# EAGLE design Cargador_RasPi3HAT_CamSlot_v1.2 (EAGLE 9.3.0)
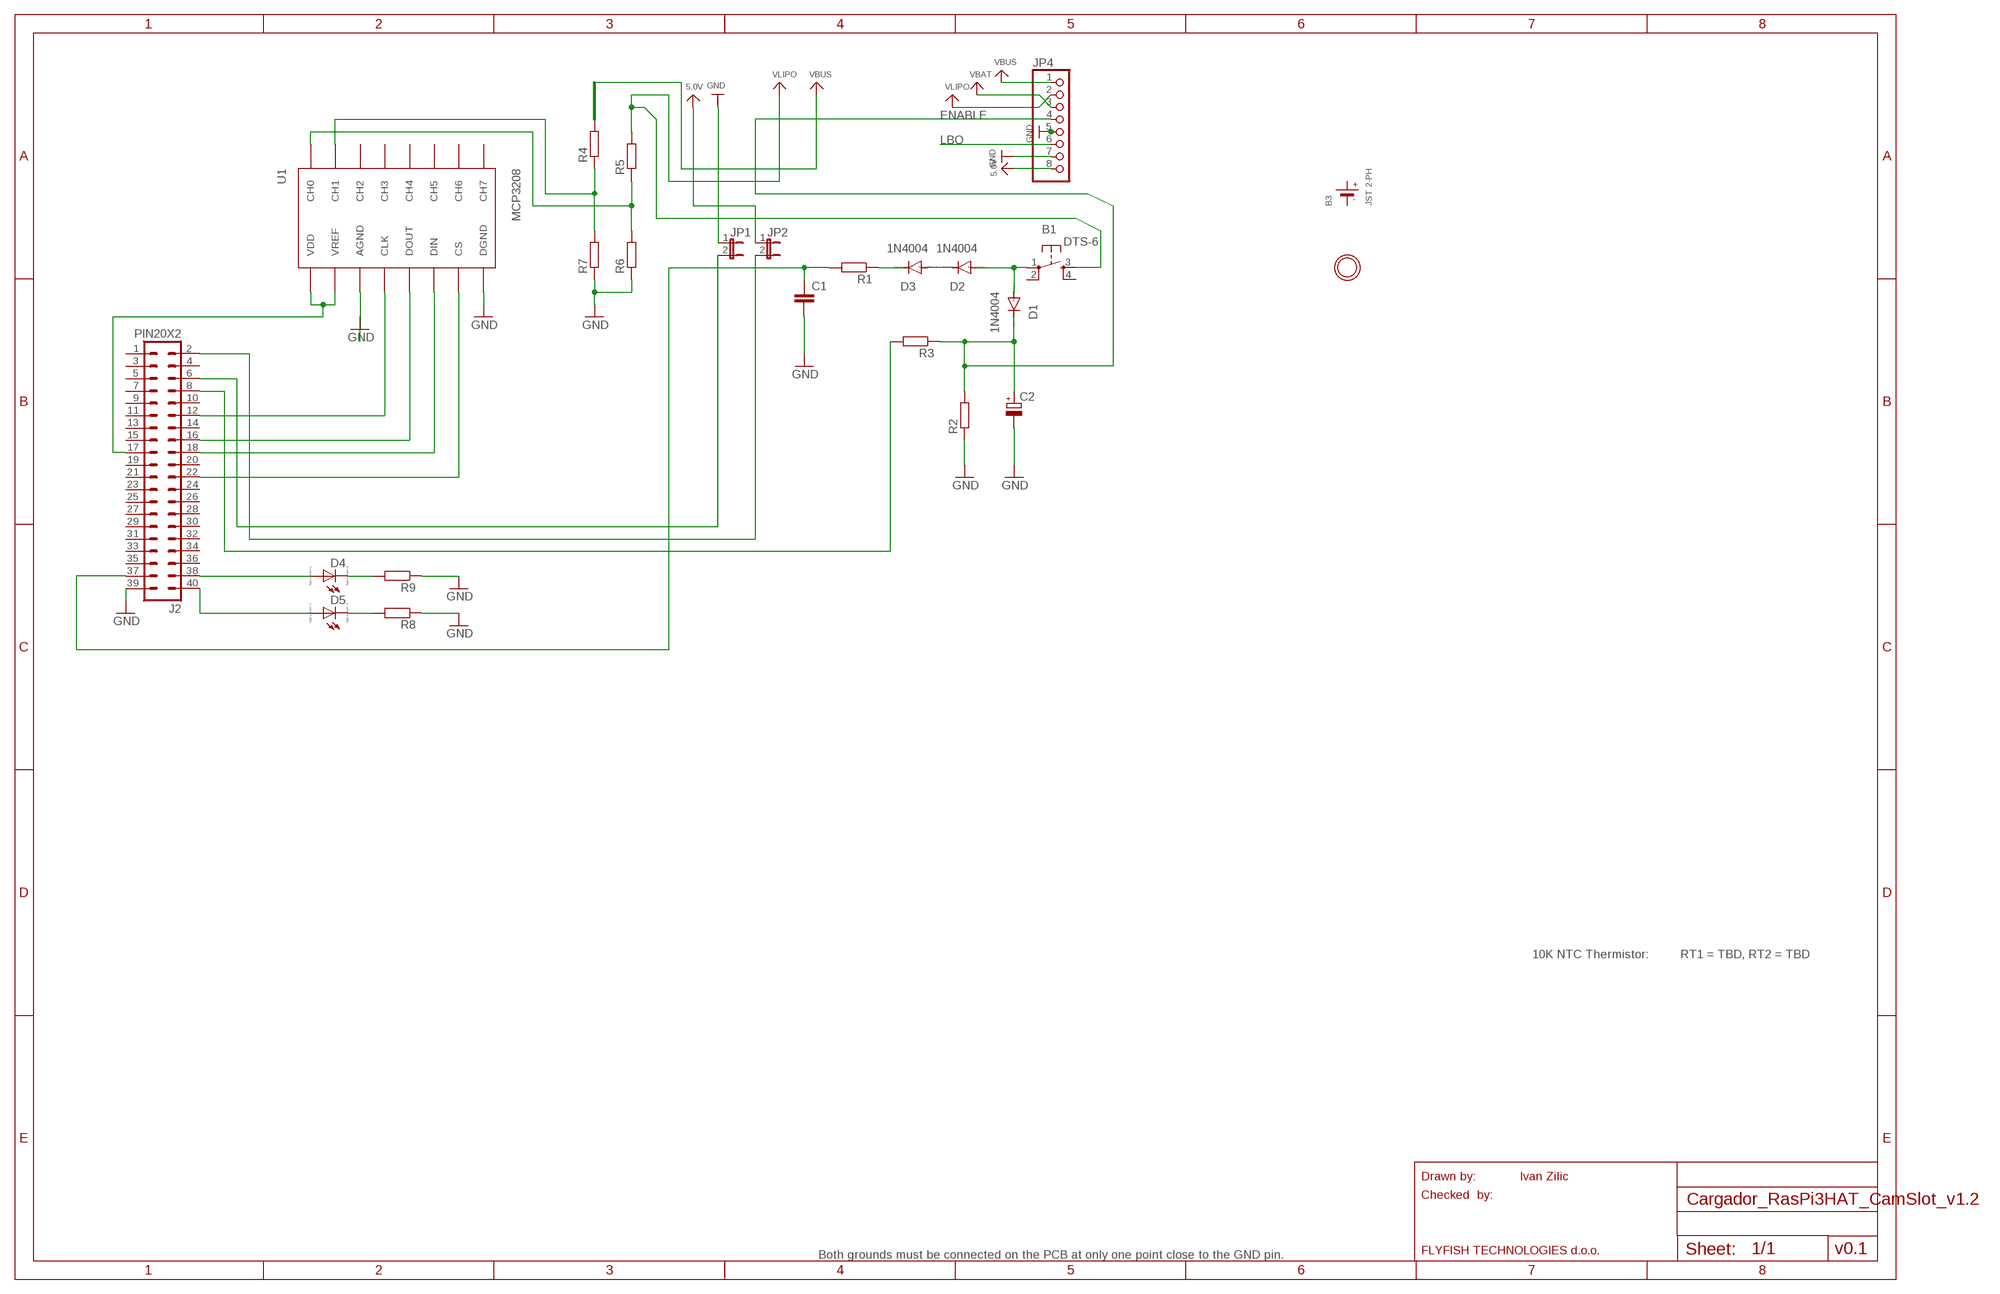
[diagram p0: schematic, sheet 1]

## Parts
B1  DTS-6  [DTS-6]
B3  JST 2-PH  BATTERY  [JSTPH2]
C1  C2.5/2  [C2.5-2]
C2  CPOL-EUE5-4  [E5-4]
D1  1N4004  [DO41-10]
D2  1N4004  [DO41-10]
D3  1N4004  [DO41-10]
D4  LED_ELD260  [LED_LD260]
D5  LED_ELD260  [LED_LD260]
J2  PIN20X2  [PIN_20X2]
JP1  JP1E  [JP1]
JP2  JP1E  [JP1]
JP4  HEADER-1X8  [1X08_OVAL]
R1  R-EU_0207/10  [0207/10]
R2  R-EU_0207/10  [0207/10]
R3  R-EU_0207/10  [0207/10]
R4  R-EU_0207/10  [0207/10]
R5  R-EU_0207/10  [0207/10]
R6  R-EU_0207/10  [0207/10]
R7  R-EU_0207/10  [0207/10]
R8  R-EU_0207/10  [0207/10]
R9  R-EU_0207/10  [0207/10]
U1  MCP3208  [DIL16]
U$5  MOUNTINGHOLE2.5  [MOUNTINGHOLE_2.5_PLATED]

## Nets
5.0V: JP2.1 JP4.8
ENABLE: C2.+ D1.C JP4.4 R2.2 R3.1
GND [GND]: C1.2 C2.- J2.39 JP1.1 JP4.5 JP4.7 R2.1 R6.1 R7.1 R8.1 R9.1 U1.AGND U1.DGND
LBO: JP4.6
N$1: J2.6 JP1.2
N$2: J2.8 R3.2
N$3: D4.K(C) R9.2
N$4: D5.K(C) R8.2
N$5: D3.C R1.1
N$6: D5.A J2.40
N$7: D4.A J2.38
N$8: J2.22 U1.CS
N$9: J2.16 U1.DOUT
N$10: J2.18 U1.DIN
N$11 [GND]: J2.12 U1.CLK
N$12: J2.17 U1.VDD U1.VREF
N$13 [GND]: R4.1 R7.2 U1.CH1
N$14: R5.1 R6.2 U1.CH0
N$20: J2.2 JP2.2
N$21: C1.1 J2.37 R1.2
N$23: D2.C D3.A
N$24 [GND]: B1.1 D1.A D2.A
VBAT: JP4.3
VBUS: JP4.1 R4.2
VLIPO: B1.3 JP4.2 R5.2
Unconnected: B1.2 B1.4 B3.1(-) B3.2(+) J2.1 J2.3 J2.4 J2.5 J2.7 J2.9 J2.10 J2.11 J2.13 J2.14 J2.15 J2.19 J2.20 J2.21 J2.23 J2.24 J2.25 J2.26 J2.27 J2.28 J2.29 J2.30 J2.31 J2.32 J2.33 J2.34 J2.35 J2.36 U1.CH2 U1.CH3 U1.CH4 U1.CH5 U1.CH6 U1.CH7

## Notes on the sheet
- 10K NTC Thermistor: | RT1 = TBD, RT2 = TBD
- Drawn by: | Ivan Zilic
- Checked  by:
- Both grounds must be connected on the PCB at only one point close to the GND pin. | FLYFISH TECHNOLOGIES d.o.o. | v0.1

## Library data of the parts
B1 = switch-tact:DTS-6
B3 = microbuilder:BATTERY: CR1220 SMT - Digikey: 3001K-ND CD2032 BAT-HLD-001 - Digikey: BAT-HLD-001-ND
C1 = capacitor-wima:C: CAPACITOR naming: grid - package width
C2 = rcl:CPOL-EU: POLARIZED CAPACITOR, European symbol; SPICEPREFIX: C
D1-D3 = diode:1N4004: DIODE general purpose rectifier, 1 A
D4 D5 = eagle-ltspice:LED_E: LED Source: http://www.osram.convergy.de Source: www.luxeon.com Source: www.kingbright.com; SPICEMODEL: NONE; SPICEPREFIX: D; SPICETYPE: diode
J2 = FLYFISH:PIN20X2
JP1 JP2 = jumper:JP1E: JUMPER
JP4 = microbuilder:HEADER-1X8: PIN HEADER
R1-R9 = rcl:R-EU_: RESISTOR, European symbol; SPICEPREFIX: R
U1 = mcp3208:MCP3208
U$5 = microbuilder:MOUNTINGHOLE: Mounting Hole For #2 screws (0.086"/2.18mm width, 0.094"/2.4mm hole) use 2.5mm

## Net classes
1 GND: width 0.254 mm, clearance 0.381 mm

## Board
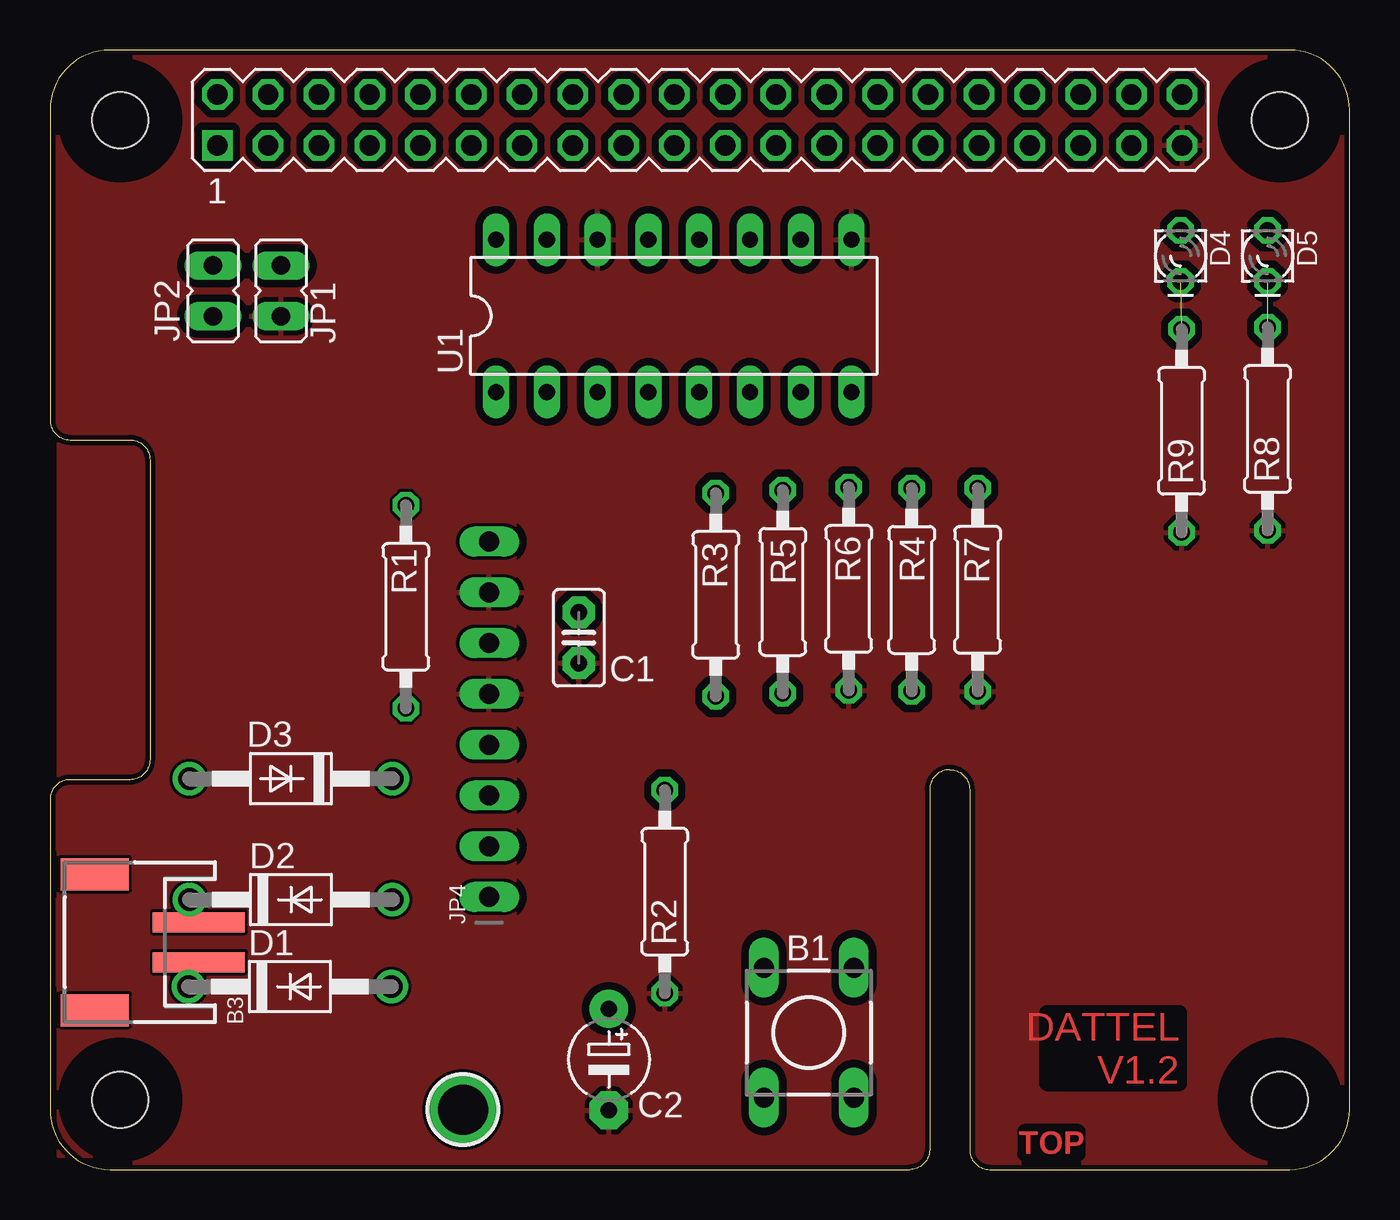
[diagram p1: board, top side]
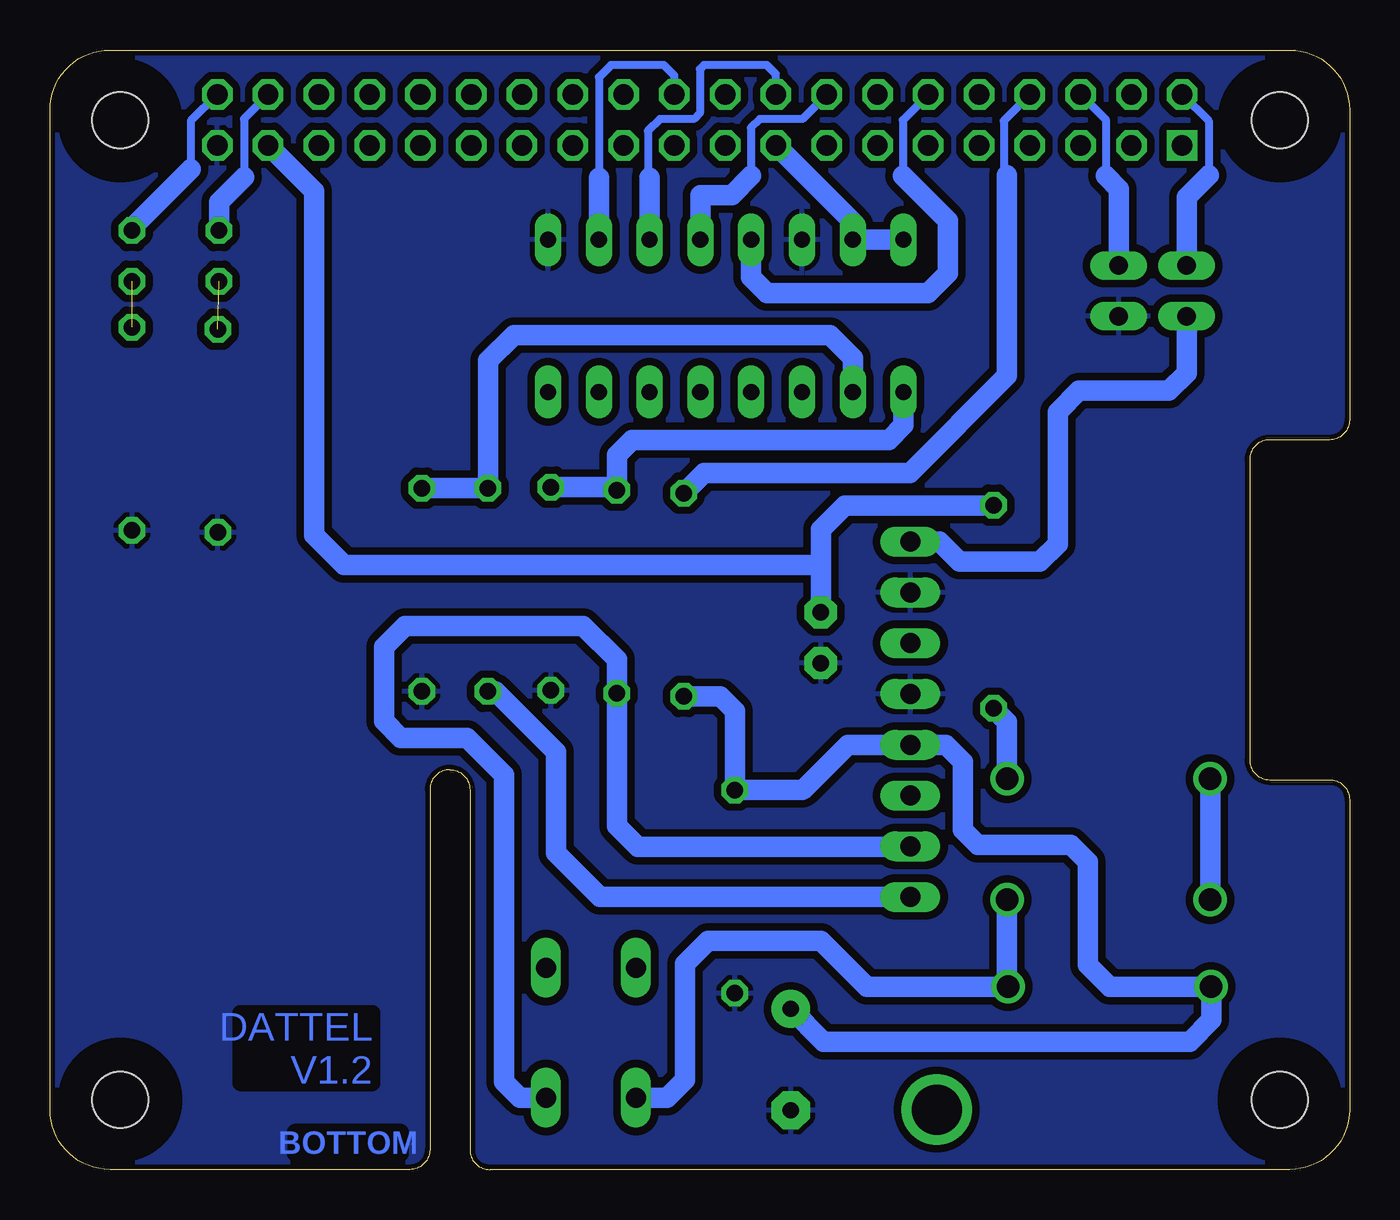
[diagram p2: board, bottom side, seen from below]

Size 65 x 56 mm. Coordinates in mm from the lower left corner, seen from the top.
Outline: 0,3 arc90 3,0 43,0 arc90 44,1 44,19 arc-90 45,20 arc-90 46,19 46,1 arc90 47,0 62,0 arc90 65,3 65,53 arc90 62,56 3,56 arc90 0,53 0,37.5 arc90 1,36.5 4,36.5 arc-90 5,35.5 5,20.5 arc-90 4,19.5 1,19.5 arc90 0,18.5 0,3
Copper layers (1*16): Top 0.035mm / dielectric 1.5mm / Bottom 0.035mm
Design rules "ITEADstudio_DRC": minimum track width 6mil, minimum drill 12mil, track to track 6mil, track to pad 6mil, pad to pad 6mil, via to via 6mil, smd to smd 0mil, copper to edge 10mil, drill to drill 10mil, minimum pad ring 10mil, minimum via ring 6mil, stop-mask expansion 2mil, vias tented up to drill 100mil, thermal gap 10mil
Holes 2.8 mm at 3.5,3.5 3.5,52.5 61.5,52.5 61.5,3.5
tRestrict: area 1.9,51 to 5,54; area 60,51 to 63,54; area 60,1.9 to 63,5; area 1.9,1.9 to 5,5
bRestrict: area 1.9,1.9 to 5,5; area 1.9,51 to 5,54; area 60,1.9 to 63,5; area 60,51 to 63,54

### Footprints (pad centres in the part's own frame; a part is rotated, then mirrored left to right if it is on the bottom)
DTS-6 = drill 1 long: 1 -3.25,2.25; 2 3.25,2.25; 3 -3.25,-2.25; 4 3.25,-2.25
JSTPH2 = smd 1 x 4.6: 1 -1,-3.7; 2 1,-3.7 | smd 1.6 x 3.4: NC1 -3.4,1.5; NC2 3.4,1.5
C2.5-2 = drill 0.813 pad 1.6 octagon: 1 -1.27,0; 2 1.27,0
E5-4 = drill 0.813 pad 1.905: + -2.54,0 | drill 0.813 pad 1.905 octagon: - 2.54,0
DO41-10 = drill 1.118: A 5.08,0; C -5.08,0
LED_LD260 = drill 0.813 octagon: A -1.27,0; K 1.27,0
PIN_20X2 = drill 1.016 square: 1 -24.13,-1.27 | drill 1.016 octagon: 2 -24.13,1.27; 3 -21.59,-1.27; 4 -21.59,1.27; 5 -19.05,-1.27; 6 -19.05,1.27; 7 -16.51,-1.27; 8 -16.51,1.27; 9 -13.97,-1.27; 10 -13.97,1.27; 11 -11.43,-1.27; 12 -11.43,1.27; 13 -8.89,-1.27; 14 -8.89,1.27; 15 -6.35,-1.27; 16 -6.35,1.27; 17 -3.81,-1.27; 18 -3.81,1.27; 19 -1.27,-1.27; 20 -1.27,1.27; 21 1.27,-1.27; 22 1.27,1.27; 23 3.81,-1.27; 24 3.81,1.27; 25 6.35,-1.27; 26 6.35,1.27; 27 8.89,-1.27; 28 8.89,1.27; 29 11.43,-1.27; 30 11.43,1.27; 31 13.97,-1.27; 32 13.97,1.27; 33 16.51,-1.27; 34 16.51,1.27; 35 19.05,-1.27; 36 19.05,1.27; 37 21.59,-1.27; 38 21.59,1.27; 39 24.13,-1.27; 40 24.13,1.27
JP1 = drill 0.914 long: 1 0,-1.27; 2 0,1.27
1X08_OVAL = drill 1 long: 1 -8.89,0; 2 -6.35,0; 3 -3.81,0; 4 -1.27,0; 5 1.27,0; 6 3.81,0; 7 6.35,0; 8 8.89,0
0207/10 = drill 0.813 octagon: 1 -5.08,0; 2 5.08,0
DIL16 = drill 0.813 long: AGND -3.81,3.81; CH0 -8.89,-3.81; CH1 -6.35,-3.81; CH2 -3.81,-3.81; CH3 -1.27,-3.81; CH4 1.27,-3.81; CH5 3.81,-3.81; CH6 6.35,-3.81; CH7 8.89,-3.81; CLK -1.27,3.81; CS 6.35,3.81; DGND 8.89,3.81; DIN 3.81,3.81; DOUT 1.27,3.81; VDD -8.89,3.81; VREF -6.35,3.81
MOUNTINGHOLE_2.5_PLATED = drill 2.5 pad 3.2: P$1 0,0

### Placement (x,y rotation side)
B1  37.95,6.85 90 top
B3  3.74,11.37 90 top
C1  26.45,26.6 270 top
C2  27.95,5.5 270 top
D1  12,9.15 0 top
D2  12.05,13.5 0 top
D3  12.05,19.55 180 top
D4  56.55,45.7 270 top
D5  60.9,45.7 270 top
J2  32.5,52.5 0 top
JP1  11.55,43.95 0 top
JP2  8.15,43.95 0 top
JP4  21.97,22.52 90 top
R1  17.8,28.15 90 top
R2  30.75,13.9 90 top
R3  33.3,28.75 90 top
R4  43.1,29 270 top
R5  36.65,28.9 270 top
R6  39.95,29.05 90 top
R7  46.4,29 90 top
R8  60.9,37.05 90 top
R9  56.6,36.95 90 top
U1  31.2,42.7 0 top
U$5  20.65,3 0 top

### Tracks (layer width: path | path; a pad name or v marks a point on that pad's centre or on a via)
5.0V
  Bottom 1.016: JP2.1 8.15,39.85 9.05,38.95 13.55,38.95 14.6,37.9 14.6,31.3 15.49,30.41 19.52,30.41 20.52,31.41 JP4.8
BOOSTER
  pour Top: 0.4,36.97 23.26,36.97 23.26,0.65 0.4,0.65
ENABLE
  Bottom 0.254: 21.99,21.23 JP4.4
  Bottom 1.016: C2.+ 26.31,6.4 8,6.4 6.92,7.48 D1.C 12,9.15 13.1,10.25 13.1,15.4 13.95,16.25 18.6,16.25 19.35,17 19.35,20.4 20.18,21.23 21.99,21.23 25.09,21.23 27.29,19.03 27.35,19.03 27.4,18.98 R2.2 30.75,22.95 31.47,23.67 R3.1 | JP4.4 21.89,21.33
GND
  pour Bottom: 0,3 arc90 3,0 43,0 arc90 44,1 44,19 arc-90 45,20 arc-90 46,19 46,1 arc90 47,0 62,0 arc90 65,3 65,53 arc90 62,56 3,56 arc90 0,53 0,37.5 arc90 1,36.5 4,36.5 arc-90 5,35.5 5,20.5 arc-90 4,19.5 1,19.5 arc90 0,18.5
  pour Top: 0,3 arc90 3,0 43,0 arc90 44,1 44,19 arc-90 45,20 arc-90 46,19 46,1 arc90 47,0 62,0 arc90 65,3 65,53 arc90 62,56 3,56 arc90 0,53 0,37.5 arc90 1,36.5 4,36.5 arc-90 5,35.5 5,20.5 arc-90 4,19.5 1,19.5 arc90 0,18.5
  pour Bottom: -0.55,56.8 63.95,56.8 66.15,54.6 66.15,1.15 64.35,-0.65 1.2,-0.65 -1,1.55 -1,56.35
N$1
  Bottom 0.406: J2.6 12.2,52.52 12.2,49.7
  Bottom 1.016: 12.2,49.7 11.55,49.05 JP1.2
N$2
  Bottom 0.254: 17.3,49.9 17.15,49.75
  Bottom 0.406: J2.8 17.3,52.46 17.3,49.9
  Bottom 1.016: 17.15,49.75 17.15,39.7 22,34.85 32.28,34.85 R3.2
N$3  (1 unrouted)
N$4  (1 unrouted)
N$5
  Bottom 1.016: R1.1 17.13,22.4 D3.C
N$6
  Bottom 0.254: 60.9,47.1 D5.A
  Bottom 0.406: J2.40 57.95,52.45 57.95,50.05
  Bottom 1.016: 57.95,50.05 59.6,48.4 60.9,47.1
N$7
  Bottom 0.406: J2.38 55.3,52.56 55.3,49.65
  Bottom 1.016: 55.3,49.65 56.55,48.4 D4.A
N$8
  Bottom 0.406: J2.22 33.77,54.72 34.3,55.25 36.95,55.25 37.55,54.65 37.55,49.6
  Bottom 1.016: 37.55,49.6 U1.CS
N$9
  Bottom 0.406: J2.16 27.37,52.55 29.5,52.55 29.95,52.1 29.95,49.7
  Bottom 1.016: 29.95,49.7 30.9,48.75 32.47,48.75 U1.DOUT
N$10
  Bottom 0.254: 35.1,49.7 35.01,49.61
  Bottom 0.406: J2.18 28.69,54.79 29.15,55.25 32.3,55.25 32.5,55.05 32.5,52.85 32.8,52.55 34.5,52.55 35.1,51.95 35.1,49.7
  Bottom 1.016: 35.01,49.61 U1.DIN
N$11
  Bottom 0.406: J2.12 22.34,52.5 22.34,49.7
  Bottom 1.016: 22.34,49.7 20.1,47.46 20.1,44.85 21.1,43.85 29.13,43.85 29.93,44.65 U1.CLK
N$12
  Bottom 1.016: U1.VDD U1.VREF 24.85,47.39 J2.17
N$13
  Bottom 1.016: R7.2 R4.1 43.1,40.45 41.8,41.75 26,41.75 24.85,40.6 U1.CH1
N$14
  Bottom 0.254: R5.1 36.8,34.13
  Bottom 1.016: 36.53,34.1 R5.1 36.65,35.75 35.9,36.5 23.05,36.5 22.31,37.24 U1.CH0 | 36.8,34.13 R6.2
N$20
  Bottom 0.406: J2.2 7.05,52.45 7.05,49.75
  Bottom 1.016: 7.05,49.75 8.15,48.65 JP2.2
N$21
  Bottom 1.016: R1.2 17.83,33.2 25.25,33.2 26.43,32.02 26.43,30.25 | 26.43,30.25 26.43,27.9 C1.1 | J2.37 51.8,48.94 51.8,31.75 50.3,30.25 26.43,30.25
N$23
  Bottom 1.016: D2.C D3.A
N$24
  Bottom 1.016: D2.A 17.13,9.2 D1.A 24.13,9.15 26.43,11.45 32.1,11.45 33.25,10.3 33.25,4.5 34.15,3.6 B1.1
VBUS
  Bottom 1.016: R4.2 42.72,23.92 39.7,20.9 39.7,15.85 37.48,13.63 JP4.1
VLIPO
  Bottom 0.254: 21.99,16.15 JP4.2
  Bottom 1.016: 21.99,16.15 35.6,16.15 36.65,17.2 R5.2 36.65,25.52 38.33,27.2 47.25,27.2 48.3,26.15 48.3,22.45 47.45,21.6 44.15,21.6 42.3,19.75 42.3,4.4 41.5,3.6 B1.3

### Text on the board
Top: DATTEL / V1.2 | TOP
Bottom: DATTEL / V1.2 | BOTTOM